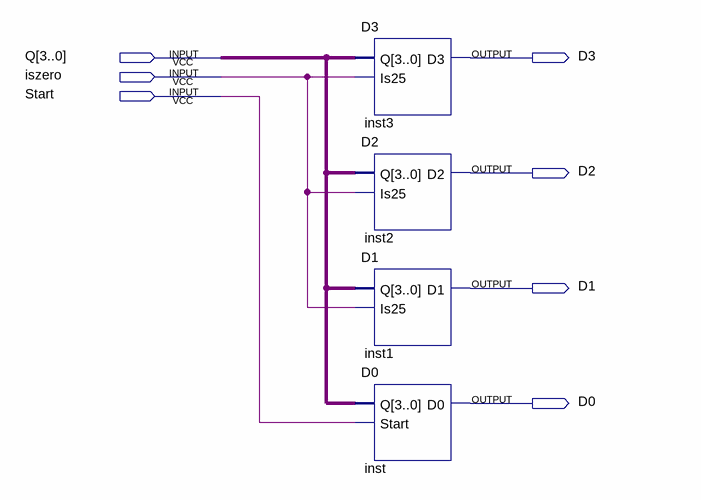
[diagram p0: schematic sheet]
// Quartus schematic Divison_DFF.bdf as structural Verilog: 4 symbols, 7 pins
module Divison_DFF (
  input  [3:0] Q,
  input  iszero,
  input  Start,
  output D3,
  output D2,
  output D1,
  output D0
);

  D3 inst3 (.Q(Q), .Is25(iszero), .D3(D3));
  D2 inst2 (.Q(Q), .Is25(iszero), .D2(D2));
  D1 inst1 (.Q(Q), .Is25(iszero), .D1(D1));
  D0 inst (.Q(Q), .Start(Start), .D0(D0));
endmodule
